# EAGLE board P1R5 (EAGLE 7.2.0)
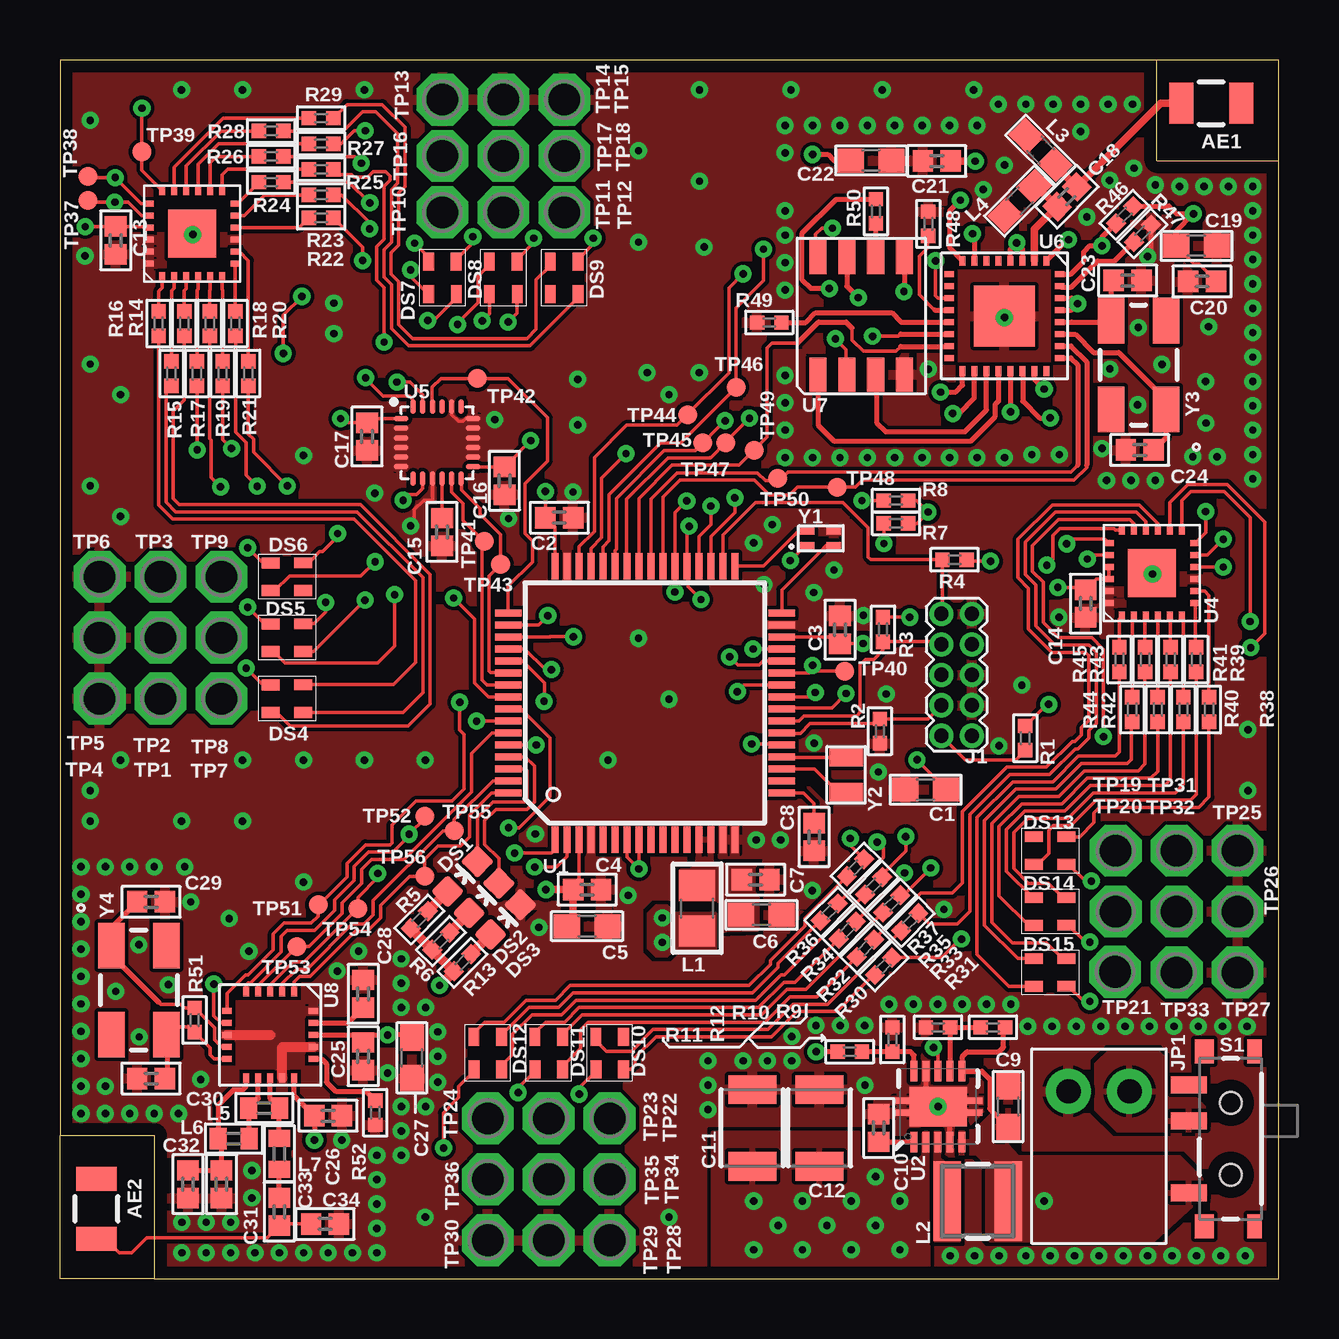
[diagram p6: board, top side]
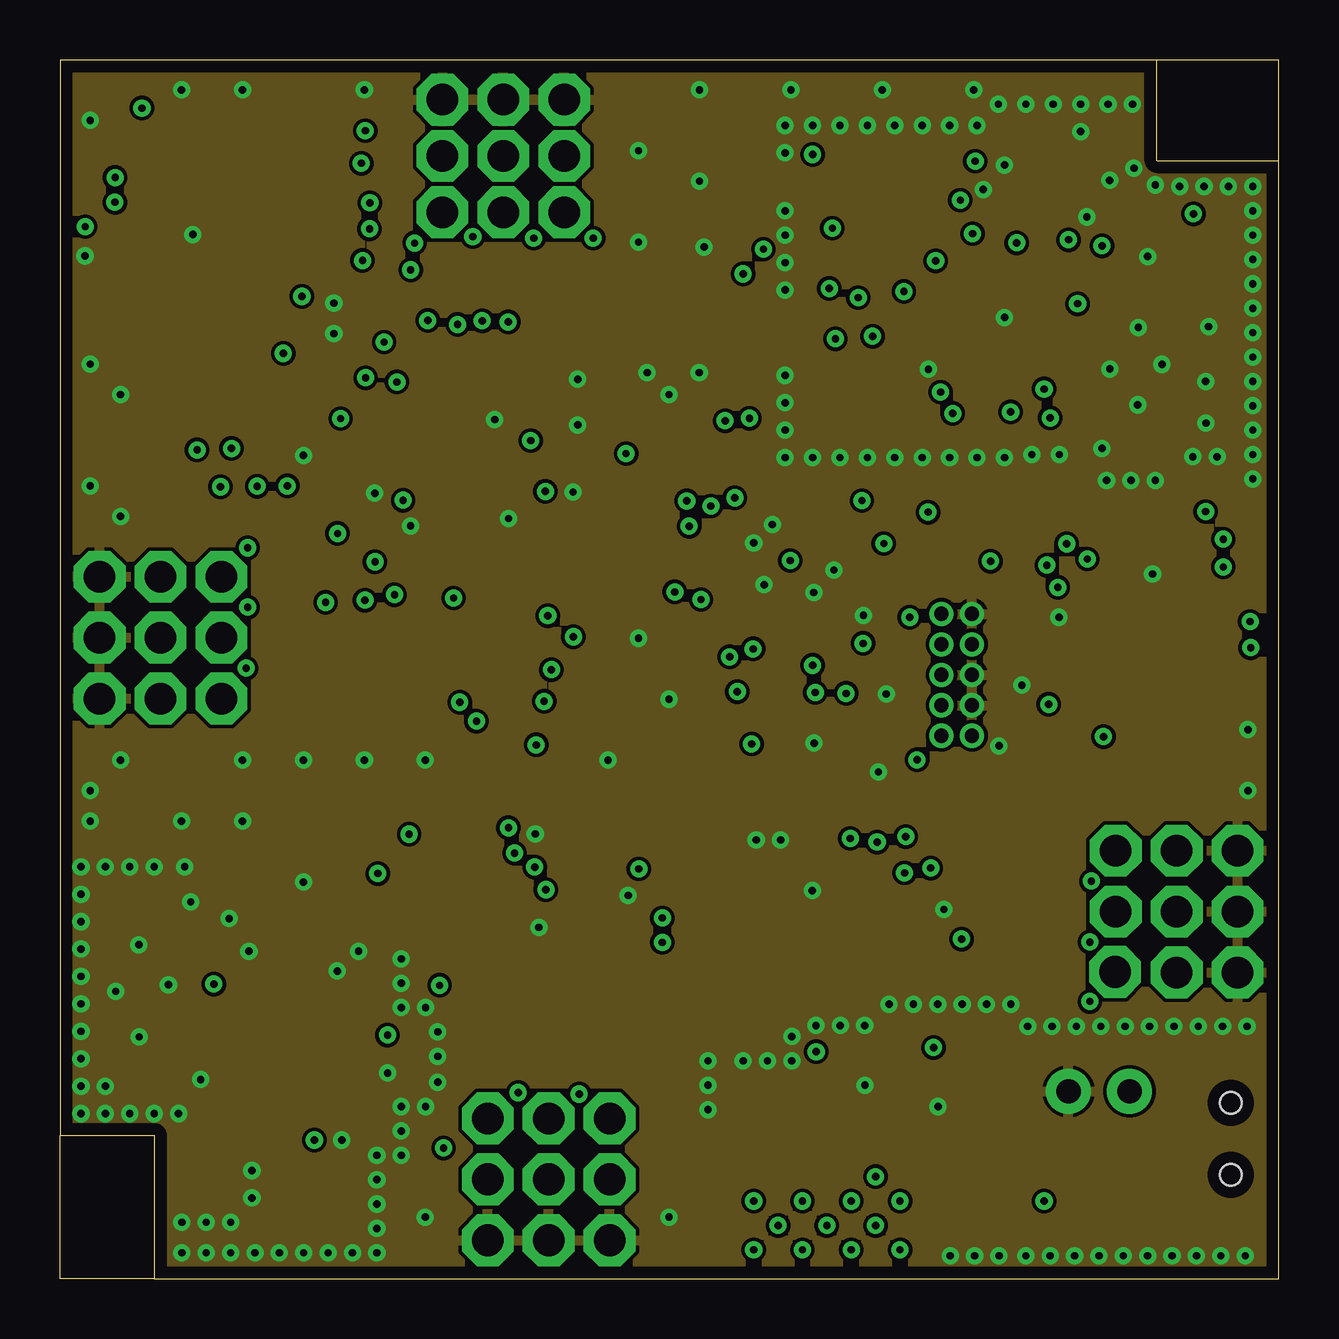
[diagram p7: board, inner layer Route2]
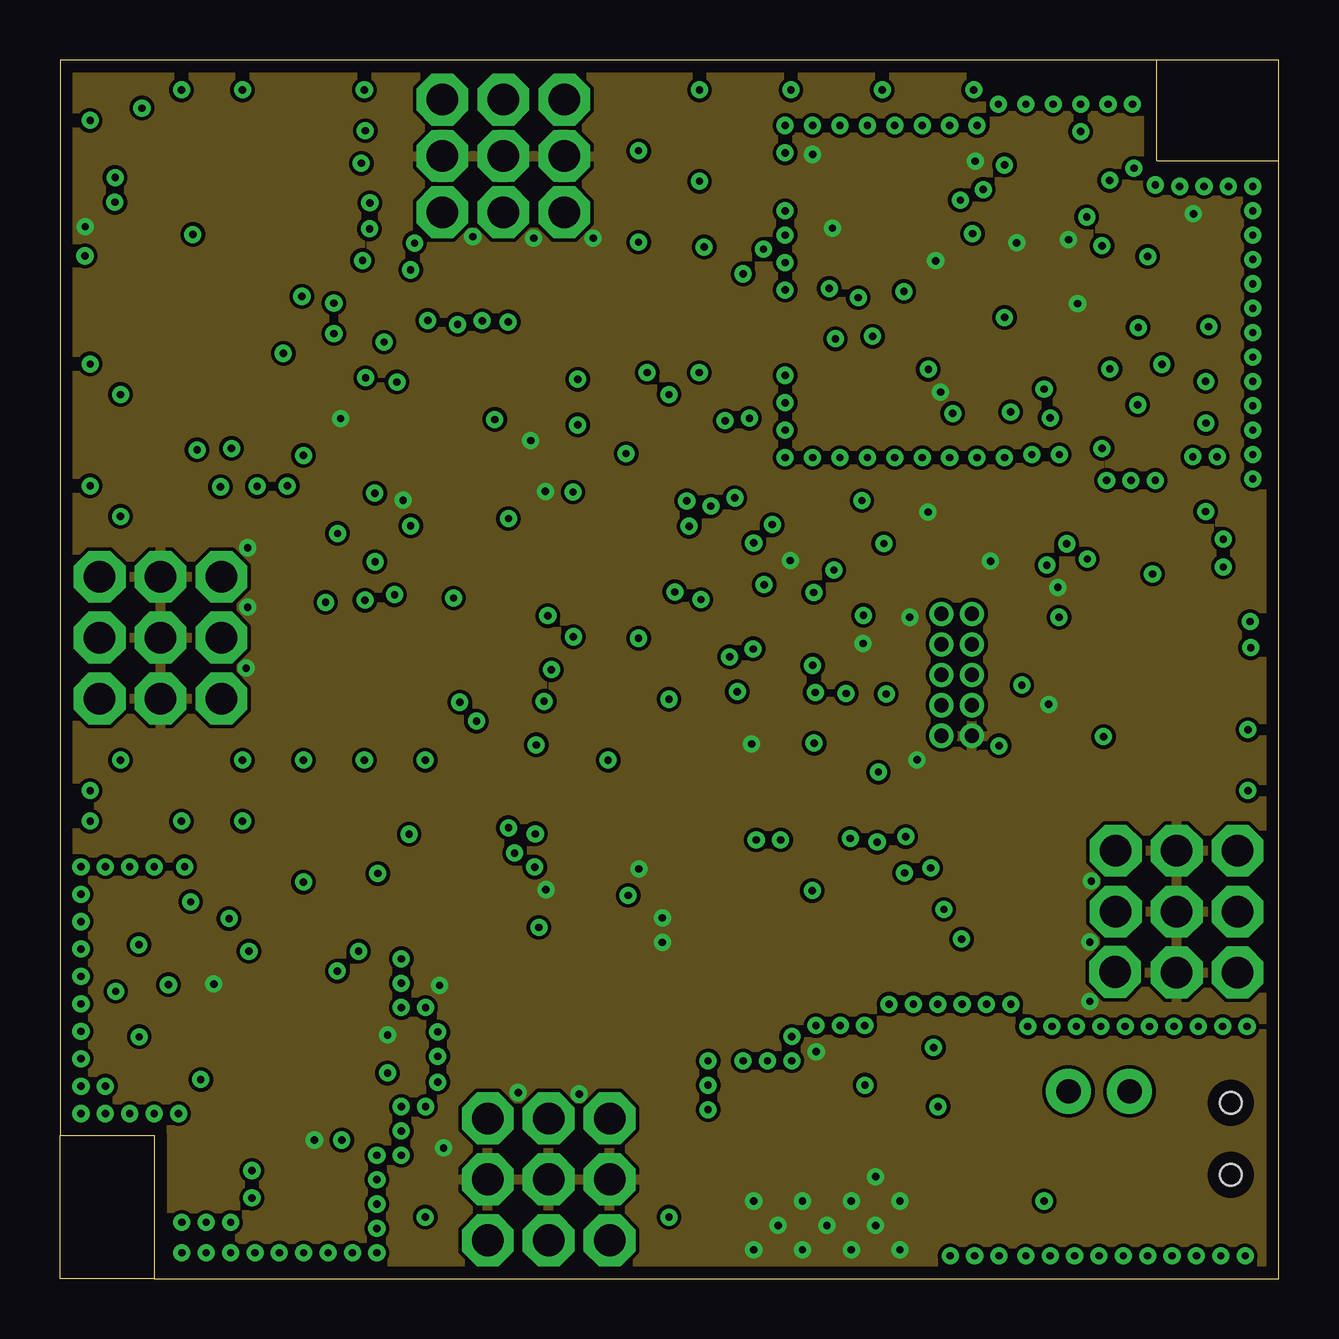
[diagram p8: board, inner layer Route15]
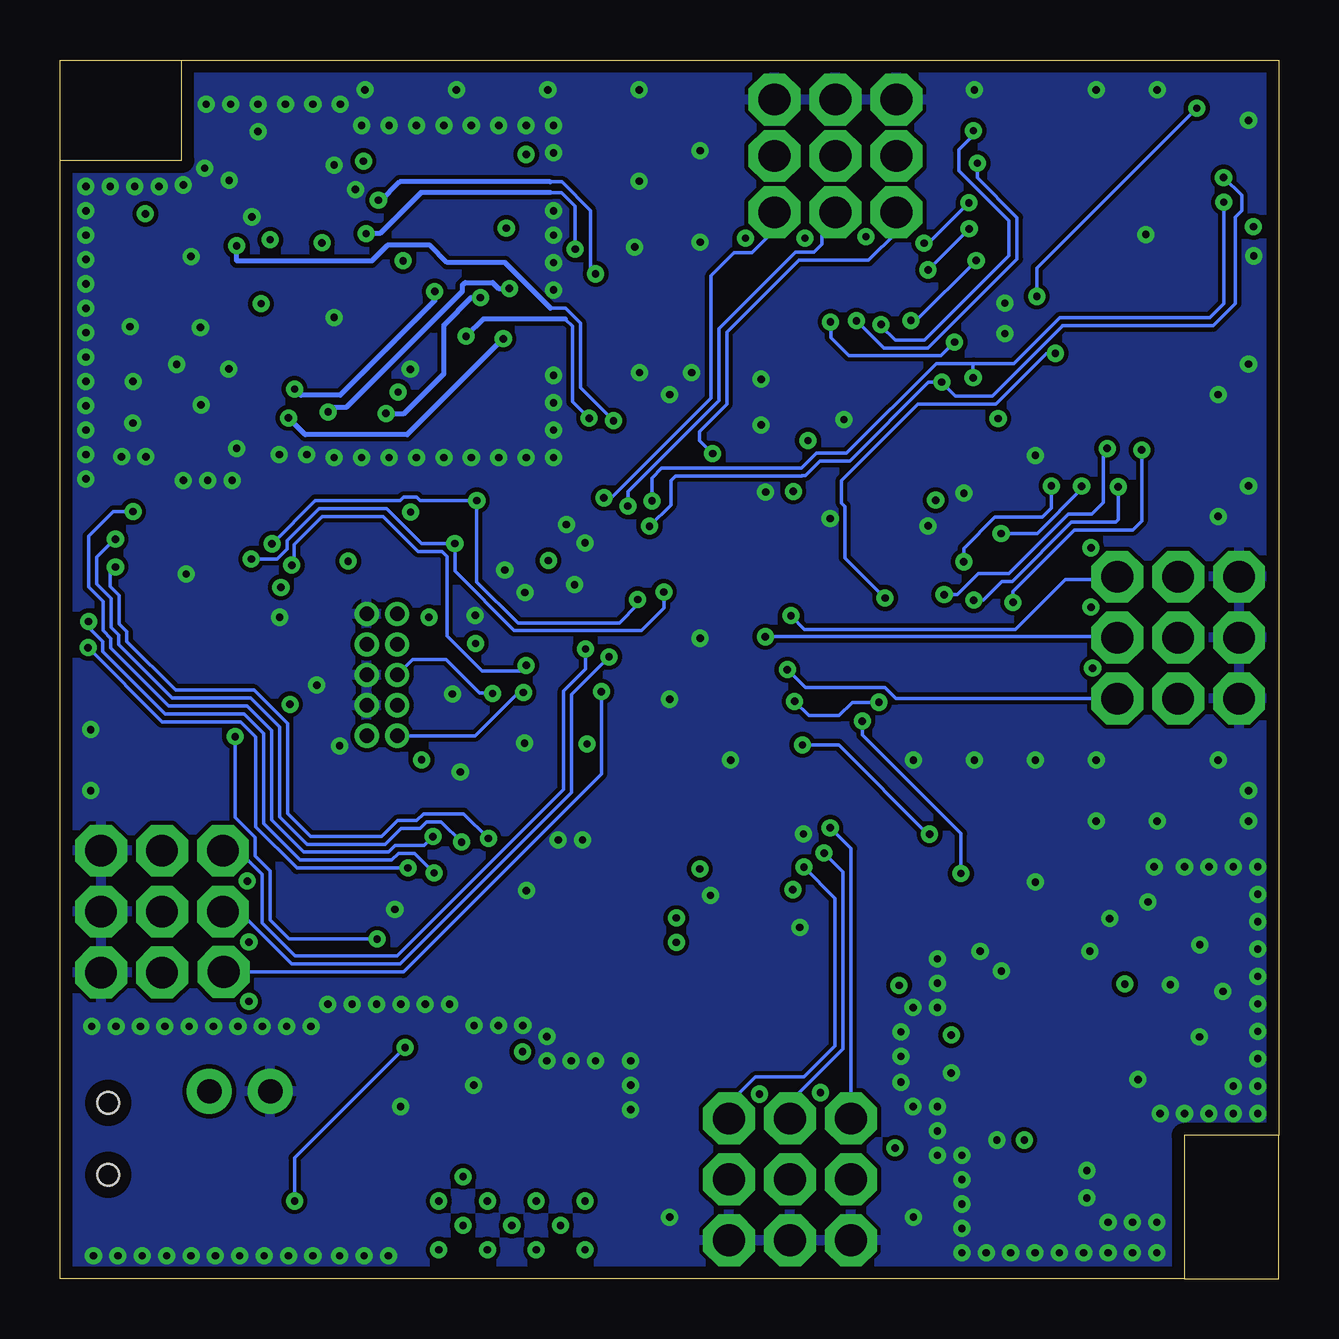
[diagram p9: board, bottom side, seen from below]

Size 50.8 x 50.8 mm. Coordinates in mm from the lower left corner, seen from the top.
Outline: 3.94,0 50.8,0 50.8,46.61
Outline: 45.72,50.8 0,50.8 0,5.97
Outline: 50.8,46.61 45.72,46.61 45.72,50.8
Outline: 50.8,46.61 50.8,50.8 45.72,50.8
Outline: 0,5.97 0,0 3.94,0
Outline: 0,5.97 3.94,5.97 3.94,0
Copper layers (1*2*15*16): Top 0.035559375mm / dielectric 10mil / Route2 0.035559375mm / dielectric 40mil / Route15 0.035559375mm / dielectric 10mil / Bottom 0.035559375mm
Design rules "Clay *": minimum track width 6mil, minimum drill 12mil, track to track 6mil, track to pad 6mil, pad to pad 6mil, via to via 6mil, smd to smd 6mil, copper to edge 20mil, drill to drill 28mil, minimum pad ring 8mil, minimum via ring 8mil, stop-mask expansion 1mil, vias tented up to drill 0mil, thermal gap 6mil
Net classes: 1 USB: width 0.254 mm, drill 0.33 mm, clearance 0.159 mm
bRestrict: area 46,47.6 to 50.5,50.3; area -0.1,0.9 to 3.9,5.7

## Footprints (pad centres in the part's own frame; a part is rotated, then mirrored left to right if it is on the bottom)
ANTENNA-CHIP2 = smd 1.7 x 1: FEED 0,1.25; P$2 0,-1.25
0603-CAP = smd 1.1 x 1: 1 -0.85,0; 2 0.85,0
0402-CAP = smd 0.85 x 0.9: 1 -0.58,0; 2 0.58,0
1210 = smd 1.2 x 2: 1 -1.6,0; 2 1.6,0
LED-0603 = smd 1 x 1: A 0,-0.877; C 0,0.877
LTST-C19FD1WT = smd 0.75 x 0.45: 1 0.68,0.58; 2 -0.68,0.58; 3 -0.68,-0.58; 4 0.68,-0.57
2X5_0.05"_TH_NS = drill 0.6 pad 0.95: 1 -2.54,-0.635; 2 -2.54,0.635; 3 -1.27,-0.635; 4 -1.27,0.635; 5 0,-0.635; 6 0,0.635; 7 1.27,-0.635; 8 1.27,0.635; 9 2.54,-0.635; 10 2.54,0.635
JST_2PIN = drill 1.016 pad 1.88: 1 0,0; 2 2.54,0
0805 = smd 1.3 x 1.5: 1 -0.95,0; 2 0.95,0
LPS3015 = smd 1.14 x 3.3: 1 -1.27,0; 2 1.27,0
0603 = smd 1.1 x 1: 1 -0.85,0; 2 0.85,0
C0402 = smd 0.7 x 0.9: 1 -0.65,0; 2 0.65,0
_0402 = smd 0.6 x 0.6: 1 -0.508,0; 2 0.508,0
SWITCH-SPST-SMD-A = smd 0.7 x 1.5: 1 -2.25,-1.75; 2 -0.75,-1.75; 3 2.25,-1.75 | smd 1 x 0.6: GND1 -3.65,1; GND3 3.65,1 | smd 1 x 0.8: GND2 -3.65,-1.1; GND4 3.65,-1.1 | hole 0.9: -1.5,0; 1.5,0
P1-13 = drill 1.321 pad 2.159 octagon: TP 0,0
TP08R = smd 0.8 x 0.8: TP 0,0
MK20DX256VLH7 = smd 1.1 x 0.285: 1 -5.7,3.75; 2 -5.7,3.25; 3 -5.7,2.75; 4 -5.7,2.25; 5 -5.7,1.75; 6 -5.7,1.25; 7 -5.7,0.75; 8 -5.7,0.25; 9 -5.7,-0.25; 10 -5.7,-0.75; 11 -5.7,-1.25; 12 -5.7,-1.75; 13 -5.7,-2.25; 14 -5.7,-2.75; 15 -5.7,-3.25; 16 -5.7,-3.75; 33 5.7,-3.75; 34 5.7,-3.25; 35 5.7,-2.75; 36 5.7,-2.25; 37 5.7,-1.75; 38 5.7,-1.25; 39 5.7,-0.75; 40 5.7,-0.25; 41 5.7,0.25; 42 5.7,0.75; 43 5.7,1.25; 44 5.7,1.75; 45 5.7,2.25; 46 5.7,2.75; 47 5.7,3.25; 48 5.7,3.75 | smd 0.285 x 1.1: 17 -3.75,-5.7; 18 -3.25,-5.7; 19 -2.75,-5.7; 20 -2.25,-5.7; 21 -1.75,-5.7; 22 -1.25,-5.7; 23 -0.75,-5.7; 24 -0.25,-5.7; 25 0.25,-5.7; 26 0.75,-5.7; 27 1.25,-5.7; 28 1.75,-5.7; 29 2.25,-5.7; 30 2.75,-5.7; 31 3.25,-5.7; 32 3.75,-5.7; 49 3.75,5.7; 50 3.25,5.7; 51 2.75,5.7; 52 2.25,5.7; 53 1.75,5.7; 54 1.25,5.7; 55 0.75,5.7; 56 0.25,5.7; 57 -0.25,5.7; 58 -0.75,5.7; 59 -1.25,5.7; 60 -1.75,5.7; 61 -2.25,5.7; 62 -2.75,5.7; 63 -3.25,5.7; 64 -3.75,5.7
QFN-10_PAD = smd 0.297 x 0.85: 1 -1,-1.475; 2 -0.5,-1.475; 3 0,-1.475; 4 0.5,-1.475; 5 1,-1.475; 6 1,1.475; 7 0.5,1.475; 8 0,1.475; 9 -0.5,1.475; 10 -1,1.475 | smd 0.7 x 0.28: 11 -1.5,0.25; 12 -1.5,-0.25; 13 1.5,0.25; 14 1.5,-0.25 | smd 2.4 x 1.65: 15 0,0
HVQFN24 = smd 0.4 x 0.25: 1 -1.8,1.25; 2 -1.8,0.75; 3 -1.8,0.25; 4 -1.8,-0.25; 5 -1.8,-0.75; 6 -1.8,-1.25; 13 1.8,-1.25; 14 1.8,-0.75; 15 1.8,-0.25; 16 1.8,0.25; 17 1.8,0.75; 18 1.8,1.25 | smd 0.25 x 0.4: 7 -1.25,-1.8; 8 -0.75,-1.8; 9 -0.25,-1.8; 10 0.25,-1.8; 11 0.75,-1.8; 12 1.25,-1.8; 19 1.25,1.8; 20 0.75,1.8; 21 0.25,1.8; 22 -0.25,1.8; 23 -0.75,1.8; 24 -1.25,1.8 | smd 2 x 2: P$1 0,0
QFN-24/3MM = smd 0.6 x 0.23: 1 -1.5,1; 2 -1.5,0.6; 3 -1.5,0.2; 4 -1.5,-0.2; 5 -1.5,-0.6; 6 -1.5,-1; 13 1.5,-1; 14 1.5,-0.6; 15 1.5,-0.2; 16 1.5,0.2; 17 1.5,0.6; 18 1.5,1 | smd 0.23 x 0.6: 7 -1,-1.5; 8 -0.6,-1.5; 9 -0.2,-1.5; 10 0.2,-1.5; 11 0.6,-1.5; 12 1,-1.5; 19 1,1.5; 20 0.6,1.5; 21 0.2,1.5; 22 -0.2,1.5; 23 -0.6,1.5; 24 -1,1.5
QFN32 = smd 0.4 x 0.25: 1 -2.3,1.75; 2 -2.3,1.25; 3 -2.3,0.75; 4 -2.3,0.25; 5 -2.3,-0.25; 6 -2.3,-0.75; 7 -2.3,-1.25; 8 -2.3,-1.75; 17 2.3,-1.75; 18 2.3,-1.25; 19 2.3,-0.75; 20 2.3,-0.25; 21 2.3,0.25; 22 2.3,0.75; 23 2.3,1.25; 24 2.3,1.75 | smd 0.25 x 0.4: 9 -1.75,-2.3; 10 -1.25,-2.3; 11 -0.75,-2.3; 12 -0.25,-2.3; 13 0.25,-2.3; 14 0.75,-2.3; 15 1.25,-2.3; 16 1.75,-2.3; 25 1.75,2.3; 26 1.25,2.3; 27 0.75,2.3; 28 0.25,2.3; 29 -0.25,2.3; 30 -0.75,2.3; 31 -1.25,2.3; 32 -1.75,2.3 | smd 2.54 x 2.54: PAD 0,0
SOP8 = smd 1.422 x 0.711: 1 -2.454,1.8; 2 -2.454,0.6; 3 -2.454,-0.6; 4 -2.454,-1.8; 5 2.454,-1.8; 6 2.454,-0.6; 7 2.454,0.6; 8 2.454,1.8
QFN20(4X4) = smd 0.4 x 0.25: 1 -1.8,1; 2 -1.8,0.5; 3 -1.8,0; 4 -1.8,-0.5; 5 -1.8,-1; 11 1.8,-1; 12 1.8,-0.5; 13 1.8,0; 14 1.8,0.5; 15 1.8,1 | smd 0.25 x 0.4: 6 -1,-1.8; 7 -0.5,-1.8; 8 0,-1.8; 9 0.5,-1.8; 10 1,-1.8; 16 1,1.8; 17 0.5,1.8; 18 0,1.8; 19 -0.5,1.8; 20 -1,1.8
ASCO = smd 0.61 x 0.305: ENABLE -0.6,0.3; GND 0.5,0.3; OUT 0.5,-0.3; VCC -0.6,-0.3
ABS06 = smd 0.762 x 1.397: P$1 -0.711,0; P$2 0.737,0
CRYSTAL-SMD-5X3 = smd 1.9 x 1.1: 1 -1.85,-1.15; 2 1.85,-1.15; 3 1.85,1.15; 4 -1.85,1.15

## Placement (x,y rotation side)
AE1  2450AT18A100E  [ANTENNA-CHIP2]  47.98,49 90 top
AE2  2450AT18A100E  [ANTENNA-CHIP2]  1.52,2.92 180 top
C1  10uF  [0603-CAP]  36.08,20.38 180 top
C2  0.1uF  [0402-CAP]  20.82,31.72 0 top
C3  0.1uF  [0402-CAP]  32.51,27.05 90 top
C4  0.1uF  [0402-CAP]  21.97,16.22 0 top
C5  10uF  [0603-CAP]  21.97,14.69 0 top
C6  10uF  [0603-CAP]  29.24,15.16 0 top
C7  0.1uF  [0402-CAP]  28.99,16.64 0 top
C8  0.1uF  [0402-CAP]  31.43,18.41 270 top
C9  10uF  [0603-CAP]  39.52,7.18 90 top
C10  0.1uF  [0402-CAP]  34.12,6.29 90 top
C11  22uF  [1210]  28.85,6.29 90 top
C12  22uF  [1210]  31.65,6.29 90 top
C13  0.1uF  [0402-CAP]  2.32,43.28 270 top
C14  0.1uF  [0402-CAP]  42.75,28.14 270 top
C15  0.1 uF  [0402-CAP]  15.93,31.13 90 top
C16  0.1 uF  [0402-CAP]  18.53,33.26 90 top
C17  0.1 uF  [0402-CAP]  12.8,35.1 270 top
C18  5.6 pF  [0402-CAP]  41.98,45.1 225 top
C19  10uF  [0603-CAP]  47.37,43.05 0 top
C20  0.1 uF  [0402-CAP]  47.6,41.57 0 top
C21  0.1 uF  [0402-CAP]  36.55,46.58 180 top
C22  10uF  [0603-CAP]  33.81,46.61 0 top
C23  15 pF  [0402-CAP]  44.5,41.61 0 top
C24  15 pF  [0402-CAP]  45.01,34.54 180 top
C25  0.1 uF  [0402-CAP]  12.64,9.27 270 top
C26  0.1 uF  [0402-CAP]  11.18,6.79 0 top
C27  10uF  [0603-CAP]  14.67,9.21 270 top
C28  .033 uF  [0402-CAP]  12.64,11.87 270 top
C29  22 pF  [0402-CAP]  3.8,15.71 0 top
C30  22 pF  [0402-CAP]  3.8,8.34 180 top
C31  2200 pF  [0402-CAP]  6.73,3.94 270 top
C32  4.7 pF  [0402-CAP]  5.33,3.94 270 top
C33  1.5 pF  [0402-CAP]  9.14,2.79 270 top
C34  1.0 pF  [0402-CAP]  11.05,2.29 0 top
DRILEGEND  [DRILEGEND]  -25.67,-27.96 0 top  (outside the outline)
DS1  LTST-C191TBKT  [LED-0603]  16.78,16.76 315 top
DS2  LTST-C191TBKT  [LED-0603]  17.67,15.87 315 top
DS3  LTST-C191TBKT  [LED-0603]  18.57,14.97 315 top
DS4  LTST-C19FD1WT  [LTST-C19FD1WT]  9.46,24.18 180 top
DS5  LTST-C19FD1WT  [LTST-C19FD1WT]  9.46,26.72 180 top
DS6  LTST-C19FD1WT  [LTST-C19FD1WT]  9.46,29.26 180 top
DS7  LTST-C19FD1WT  [LTST-C19FD1WT]  15.94,41.72 90 top
DS8  LTST-C19FD1WT  [LTST-C19FD1WT]  18.48,41.72 90 top
DS9  LTST-C19FD1WT  [LTST-C19FD1WT]  21.02,41.72 90 top
DS10  LTST-C19FD1WT  [LTST-C19FD1WT]  22.91,9.41 270 top
DS11  LTST-C19FD1WT  [LTST-C19FD1WT]  20.37,9.41 270 top
DS12  LTST-C19FD1WT  [LTST-C19FD1WT]  17.83,9.41 270 top
DS13  LTST-C19FD1WT  [LTST-C19FD1WT]  41.27,17.84 0 top
DS14  LTST-C19FD1WT  [LTST-C19FD1WT]  41.27,15.3 0 top
DS15  LTST-C19FD1WT  [LTST-C19FD1WT]  41.27,12.76 0 top
J1  2X5_0.05"_CORTEX_DEBUGTH_NOKEY_UNSHROUDED  [2X5_0.05"_TH_NS]  37.38,25.17 90 top
JP1  M20PTH  [JST_2PIN]  44.58,7.81 180 top
L1  600 Ohm/100 Mhz  [0805]  26.56,15.44 270 top
L2  2.2uH, 1.4A  [LPS3015]  38.25,3.24 0 top
L3  DNP  [0603]  40.88,47.04 135 top
L4  DNP  [0603]  39.99,44.93 225 top
L5  8.2 nH  [C0402]  8.51,7.11 180 top
L6  2.7 nH  [C0402]  7.24,5.84 180 top
L7  3.9 nH  [C0402]  9.14,5.21 270 top
R1  10k  [_0402]  40.23,22.53 270 top
R2  10k  [_0402]  34.18,22.82 90 top
R3  10k  [_0402]  34.3,27.06 270 top
R4  10k  [_0402]  37.29,29.97 180 top
R5  25  [_0402]  14.98,14.97 45 top
R6  25  [_0402]  15.88,14.07 45 top
R7  10k  [_0402]  34.85,31.48 180 top
R8  10k  [_0402]  34.85,32.44 180 top
R9  2M  [_0402]  38.89,10.48 0 top
R10  220K  [_0402]  36.6,10.48 0 top
R11  1.2M  [_0402]  32.92,9.46 180 top
R12  220K  [_0402]  34.7,9.97 270 top
R13  25  [_0402]  16.78,13.17 45 top
R14  86.6  [_0402]  4.11,39.81 270 top
R15  86.6  [_0402]  4.65,37.73 270 top
R16  86.6  [_0402]  5.18,39.81 270 top
R17  86.6  [_0402]  5.71,37.73 270 top
R18  86.6  [_0402]  6.25,39.81 270 top
R19  86.6  [_0402]  6.78,37.73 270 top
R20  86.6  [_0402]  7.32,39.81 270 top
R21  86.6  [_0402]  7.85,37.73 270 top
R22  86.6  [_0402]  10.88,44.22 0 top
R23  86.6  [_0402]  10.88,45.17 0 top
R24  86.6  [_0402]  8.8,45.71 0 top
R25  86.6  [_0402]  10.88,46.24 0 top
R26  86.6  [_0402]  8.8,46.77 0 top
R27  86.6  [_0402]  10.88,47.31 0 top
R28  86.6  [_0402]  8.8,47.84 0 top
R29  86.6  [_0402]  10.88,48.37 0 top
R30  86.6  [_0402]  34.33,13.02 225 top
R31  86.6  [_0402]  35.42,14.87 225 top
R32  86.6  [_0402]  33.57,13.78 225 top
R33  86.6  [_0402]  34.67,15.63 225 top
R34  86.6  [_0402]  32.82,14.53 225 top
R35  86.6  [_0402]  33.91,16.38 225 top
R36  86.6  [_0402]  32.06,15.28 225 top
R37  86.6  [_0402]  33.16,17.13 225 top
R38  86.6  [_0402]  47.89,23.72 270 top
R39  86.6  [_0402]  47.36,25.81 270 top
R40  86.6  [_0402]  46.82,23.72 270 top
R41  86.6  [_0402]  46.29,25.81 270 top
R42  86.6  [_0402]  45.76,23.72 270 top
R43  86.6  [_0402]  45.22,25.81 270 top
R44  86.6  [_0402]  44.69,23.72 270 top
R45  86.6  [_0402]  44.16,25.81 270 top
R46  12k  [_0402]  44.37,44.35 45 top
R47  12k  [_0402]  45.12,43.57 45 top
R48  12k  [_0402]  36.2,43.97 270 top
R49  10k  [_0402]  29.57,39.85 0 top
R50  200  [_0402]  34.01,44.49 90 top
R51  1M  [_0402]  5.61,10.78 270 top
R52  22k  [_0402]  13.14,6.92 270 top
S1  CUS-12TB  [SWITCH-SPST-SMD-A]  48.79,5.83 270 top
TP1  TPPAD1-13  [P1-13]  4.19,24.18 0 top
TP2  TPPAD1-13  [P1-13]  4.19,26.72 0 top
TP3  TPPAD1-13  [P1-13]  4.19,29.26 0 top
TP4  TPPAD1-13  [P1-13]  1.65,24.18 0 top
TP5  TPPAD1-13  [P1-13]  1.65,26.72 0 top
TP6  TPPAD1-13  [P1-13]  1.65,29.26 0 top
TP7  TPPAD1-13  [P1-13]  6.73,24.18 0 top
TP8  TPPAD1-13  [P1-13]  6.73,26.72 0 top
TP9  TPPAD1-13  [P1-13]  6.73,29.26 0 top
TP10  TPPAD1-13  [P1-13]  15.94,44.45 0 top
TP11  TPPAD1-13  [P1-13]  18.48,44.45 0 top
TP12  TPPAD1-13  [P1-13]  21.02,44.45 0 top
TP13  TPPAD1-13  [P1-13]  15.94,49.15 0 top
TP14  TPPAD1-13  [P1-13]  18.48,49.15 0 top
TP15  TPPAD1-13  [P1-13]  21.02,49.15 0 top
TP16  TPPAD1-13  [P1-13]  15.94,46.8 0 top
TP17  TPPAD1-13  [P1-13]  18.48,46.8 0 top
TP18  TPPAD1-13  [P1-13]  21.02,46.8 0 top
TP19  TPPAD1-13  [P1-13]  44.01,17.84 0 top
TP20  TPPAD1-13  [P1-13]  44.01,15.3 0 top
TP21  TPPAD1-13  [P1-13]  43.98,12.79 0 top
TP22  TPPAD1-13  [P1-13]  22.91,6.68 0 top
TP23  TPPAD1-13  [P1-13]  20.37,6.68 0 top
TP24  TPPAD1-13  [P1-13]  17.83,6.68 0 top
TP25  TPPAD1-13  [P1-13]  49.09,17.84 0 top
TP26  TPPAD1-13  [P1-13]  49.09,15.3 0 top
TP27  TPPAD1-13  [P1-13]  49.09,12.76 0 top
TP28  TPPAD1-13  [P1-13]  22.91,1.6 0 top
TP29  TPPAD1-13  [P1-13]  20.37,1.6 0 top
TP30  TPPAD1-13  [P1-13]  17.83,1.6 0 top
TP31  TPPAD1-13  [P1-13]  46.55,17.84 0 top
TP32  TPPAD1-13  [P1-13]  46.55,15.3 0 top
TP33  TPPAD1-13  [P1-13]  46.55,12.76 0 top
TP34  TPPAD1-13  [P1-13]  22.91,4.14 0 top
TP35  TPPAD1-13  [P1-13]  20.37,4.14 0 top
TP36  TPPAD1-13  [P1-13]  17.83,4.14 0 top
TP37  TPTP08R  [TP08R]  1.17,44.95 0 top
TP38  TPTP08R  [TP08R]  1.17,45.94 0 top
TP39  TPTP08R  [TP08R]  3.42,46.98 0 top
TP40  TPTP08R  [TP08R]  32.7,25.32 0 top
TP41  TPTP08R  [TP08R]  17.68,30.75 0 top
TP42  TPTP08R  [TP08R]  17.4,37.53 0 top
TP43  TPTP08R  [TP08R]  18.36,29.78 0 top
TP44  TPTP08R  [TP08R]  26.16,36.02 0 top
TP45  TPTP08R  [TP08R]  26.8,34.85 0 top
TP46  TPTP08R  [TP08R]  28.18,37.16 0 top
TP47  TPTP08R  [TP08R]  27.75,34.85 0 top
TP48  TPTP08R  [TP08R]  32.4,32.99 0 top
TP49  TPTP08R  [TP08R]  28.93,34.53 0 top
TP50  TPTP08R  [TP08R]  29.91,33.36 0 top
TP51  TPTP08R  [TP08R]  10.77,15.58 90 top
TP52  TPTP08R  [TP08R]  15.21,19.28 90 top
TP53  TPTP08R  [TP08R]  9.88,13.84 90 top
TP54  TPTP08R  [TP08R]  12.42,15.42 90 top
TP55  TPTP08R  [TP08R]  16.43,18.67 90 top
TP56  TPTP08R  [TP08R]  15.2,16.78 90 top
U1  MK20DX256VLH7  [MK20DX256VLH7]  24.38,24 90 top
U2  TPS61200  [QFN-10_PAD]  36.6,7.18 0 top
U3  PCA9552BS  [HVQFN24]  5.51,43.56 90 top
U4  PCA9552BS  [HVQFN24]  45.52,29.41 90 top
U5  MPU-9250  [QFN-24/3MM]  15.72,34.85 0 top
U6  ESP8266EX  [QFN32]  39.37,40.13 270 top
U7  25Q40  [SOP8]  33.4,40.13 90 top
U8  NRF24L01  [QFN20(4X4)]  8.76,10.16 270 top
Y1  8MHz  [ASCO]  31.75,30.86 0 top
Y2  34.728kHz  [ABS06]  32.77,21.02 270 top
Y3  26 Mhz  [CRYSTAL-SMD-5X3]  44.96,38.09 90 top
Y4  16 Mhz  [CRYSTAL-SMD-5X3]  3.29,12.03 270 top

## Tracks (layer width: path | path; a pad name or v marks a point on that pad's centre or on a via)
3.3V  (via drill 0.3 pad 0.2, 0.3 pad 0.61)
  Top 0.152: C19.1 47.28,42.29 47.5,42.29 48.18,41.61 C20.2 | U5.13 C16.2 v19.62,34.93 v19.62,34.94 | U5.1 12.97,35.85 C17.1 11.87,35.68 v11.7,35.85 | U1.3 21.63,16.46 C4.1 | 21.39,14.96 C5.1 | U1.8 v24.13,17.08 23.63,17.58 U1.7 | DS9.4 21.59,42.48 22.23,43.12 v22.23,43.37 | DS7.4 16.51,42.48 17.21,43.18 v17.21,43.43 | DS8.4 19.05,42.48 19.75,43.18 v19.75,43.37 | Y1.VCC 31.13,30.54 31.05,30.54 v30.44,29.93 | U1.21 30.05,22.29 v28.83,22.29 | U1.30 32.23,26.75 C3.1 v33.47,26.47 v33.48,26.48 | U3.21 3.66,43.86 C13.1 1.06,43.86 v1.05,43.85 | R4.1 37.86,29.91 v38.79,29.91 | 8.79,29.83 DS6.4 8.46,29.83 v7.82,30.47 | 8.79,24.75 DS4.4 8.46,24.75 v7.76,25.45 | DS5.4 8.52,27.29 v7.82,27.99 | DS12.4 17.26,8.65 16.62,8.01 16.62,7.56 15.99,6.92 v15.99,5.45 | DS10.4 22.34,8.65 21.64,7.95 v21.64,7.7 | DS11.4 19.8,8.65 19.1,7.95 v19.1,7.76 | DS15.4 42.04,12.19 42.67,11.56 v42.93,11.56 | DS13.4 42.04,17.27 42.74,16.57 v42.99,16.57 | DS14.4 42.04,14.73 42.74,14.03 v42.93,14.03 | U1.48 20.63,31.33 C2.1 v20.23,32.81 v20.23,32.82 | v41.59,28.82 42.66,28.82 C14.1 43.19,29.16 U4.22 U4.21 | R8.1 35.7,32.44 v36.18,31.95 35.71,31.48 R7.1 | R3.1 v35.42,27.57 | C1.1 36.93,20.42 v35.73,21.63 | R1.1 41.13,23.94 v41.21,23.94 | 31.5,43.18 31.5,43.54 31.75,43.79 v32.19,43.79 | v36.5,42.43 36.5,40.97 36.59,40.88 U6.11 | U8.7 6.71,10.66 6.41,10.96 v6.41,12.28 | U5.8 15.12,32.94 14.86,32.68 14.53,32.68 v14.3,32.45
  Top 0.203: R46.2 46.22,44.71 46.55,44.39 v47.24,44.39 46.52,43.66 C19.1 | U6.1 41.99,43.31 v42.04,43.31 | U6.4 39.62,42.93 v39.88,43.18 40.13,42.93 40.13,42.44 U6.3 | U6.30 42.18,40.88 v42.42,40.64 42.16,40.38 U6.29 | v31.37,46.86 32,46.86 32.26,46.61 C22.1 | 31.6,42.33 31.5,42.44 31.5,42.48 | 31.5,42.48 31.5,43.18 | v36.7,36.96 37.34,36.96 37.62,37.24 U6.17 | U6.11 37.06,40.89 | U8.18 12.33,10.16 C25.1 12.95,10.16 v13.65,10.16 14.57,10.16 C27.1 | U8.15 9.76,7.63 C26.1 v10.6,5.78 | U8.7 | R11.2 v31.52,9.46 | 31.5,42.48 U7.8
  Top 0.305: C21.1 v38.15,46.58 | 21.39,14.96 C4.1 v20.26,16.22
  Top 0.406: R5.1 R6.1 R13.1 15.83,12.23 v15.82,12.23
  other vias: 28.92,3.24 30.95,3.24 32.98,3.24 29.93,2.22 31.97,2.22 28.92,1.21 30.95,1.21 32.98,1.21 35.01,3.24 34,2.22 35.01,1.21 34,4.25 25.11,15.04 25.11,14.02
  pour Route15 (rank 6): -2.79,51.56 52.32,51.56 52.32,-1.02 -2.79,-1.02
  pour Top (isolate 0.152, rank 2, no thermals): 27.2,3.62 33.24,3.62 33.24,5.21 33.55,4.89 35.71,4.89 35.97,5.14 35.97,6.03 36.03,6.1 36.16,6.1 36.22,6.03 36.22,0.51 27.2,0.51
  pour Top (isolate 0.152): 27.2,6.1 33.3,6.1 33.3,3.62 27.2,3.62
  pour Top (isolate 0.152, no thermals): 27.33,15.23 25.62,15.23 25.3,15.54 24.85,15.54 24.54,15.23 24.54,13.77 24.85,13.45 25.3,13.45 25.62,13.77 27.33,13.77
!CS
  Top 0.152: 15.53,36.36 U5.22 15.52,37.16 15.89,37.53 TP42.TP 18.68,37.53 20.32,35.89 20.32,34.09 19.38,33.15 19.38,31.06 19.7,30.75 19.7,29.88 18.68,28.87 U1.49
!RESET0  (via drill 0.3 pad 0.2)
  Top 0.152: U3.18 3.42,46.21 TP39.TP v3.42,48.79 | U1.56 17.86,24.25 17.29,24.83 17.29,27.5 v16.41,28.37 | v9.31,38.57 9.31,40.17 v10.08,40.95
  Bottom 0.152: v10.08,40.95 10.08,42.13 v3.42,48.79 | v9.31,38.57 9.68,38.57 11.8,36.45 15.05,36.45 18.22,33.27 18.22,32.33 18.09,32.19 18.09,30.05 v16.41,28.37
!RESET1  (via drill 0.3, 0.3 pad 0.2)
  Top 0.152: U1.27 31.21,25.25 31.37,25.41 v31.37,25.57 31.61,25.32 TP40.TP 32.69,25.34 | U4.18 43.98,31.21 43.93,31.27 41.67,31.27 41.38,30.98 41.38,29.98 v41.13,29.74
  Bottom 0.152: v41.13,29.74 41.03,29.84 41.03,30.61 39.87,31.77 37.33,31.77 35.87,30.32 34.87,30.32 34.67,30.11 34.67,26.8 33.21,25.34 31.6,25.34 v31.37,25.57
CE
  Top 0.152: U8.1 9.76,12.38 9.98,12.6 10.43,12.6 12.31,14.48 12.8,14.48 13.36,15.04 13.36,15.56 14.58,16.78 TP56.TP 15.2,17.48 15.76,18.03 16.69,18.03 17.07,18.41 17.07,19.33 17.99,20.25 U1.64
CHIP_EN  (via drill 0.3 pad 0.2, 0.3 pad 0.61)
  Top 0.152: U1.44 22.63,30.51 22.89,30.76 22.89,32.68 25.03,34.82 25.87,34.82 28.18,37.13 TP46.TP 28.18,40.45 29.32,41.59 v29.32,42.91
  Top 0.203: v38.04,43.56 38.12,43.48 U6.7
  Bottom 0.152: 30.35,45.28 29.9,45.28 29.32,44.7 v29.32,42.91
  Bottom 0.203: 30.35,45.28 35.75,45.28 37.47,43.56 v38.04,43.56
CLK
  Top 0.203: R50.1 34.01,42.34 34,42.33 U7.6
CS
  Top 0.203: U6.20 39.12,36.58 38.99,36.45 38.99,35.94 37.97,34.92 32.26,34.92 31.6,35.58 U7.1 31.6,37.93
CSN
  Top 0.152: U8.2 9.26,12.31 9.86,12.9 10.3,12.9 12.18,14.78 12.68,14.78 13.06,15.16 13.06,15.76 15.96,18.67 TP55.TP 16.43,19.14 18.05,20.75 U1.63
DIO  (via drill 0.3 pad 0.2)
  Top 0.203: U7.5 35.2,41.17 v35.18,41.15 | v41.02,37.08 40.62,37.48 U6.23
  Bottom 0.203: v35.18,41.15 35.18,40.77 39.12,36.83 40.77,36.83 v41.02,37.08
DO  (via drill 0.3 pad 0.61)
  Top 0.152: v32.32,39.18 32.77,38.73 32.77,37.97
  Top 0.203: U6.22 40.13,37.82 40.13,36.58 40.83,35.88 v41.27,35.88 | 32.77,37.97 32.8,37.93 U7.2
  Bottom 0.203: v32.32,39.18 36.32,35.18 40.58,35.18 v41.27,35.88
FSYNC
  Top 0.152: U5.11 16.32,32.79 16.8,32.31 16.8,31.61 17.67,30.75 TP41.TP | U1.55 17.79,24.75 17.59,24.96 17.59,30.66 TP41.TP | 17.68,30.73 TP41.TP
GND  (via drill 0.3 pad 0.3)
  Top 0.152: U5.9 15.53,33.34 15.53,32.44 15.15,32.44 14.77,32.05 14.77,31.67 | 17.24,35.87 U5.18 17.21,35.87 16.93,35.87 16.8,35.74 16.61,35.74 16.32,36.03 U5.20 16.36,36.38
  Top 0.203: R47.2 45.47,43.92 45.47,42.74 v45.34,42.61 | U2.9 36.1,7.68 U2.15 | U2.4 37.1,6.68 U2.15 | U2.14 36.85,6.93 U2.15
  Top 0.406: U8.8 8.76,10.16 | U8.14 9.26,9.66 U8.17
  other vias: 43.69,48.96 42.55,48.96 41.4,48.96 40.26,48.96 39.12,48.96 38.23,48.07 37.08,48.07 35.94,48.07 34.8,48.07 33.66,48.07 32.51,48.07 31.37,48.07 30.23,48.07 30.23,46.93 30.23,44.51 30.23,43.5 30.23,42.35 30.23,41.21 30.23,37.66 31.37,34.23 32.51,34.23 33.66,34.23 30.23,36.51 30.23,35.37 34.8,34.23 35.94,34.23 37.08,34.23 38.23,34.23 39.37,34.23 40.51,34.35 41.66,34.35 44.64,33.27 45.66,33.27 47.22,34.26 48.23,34.26 39.37,40.07 49.72,35.37 49.72,36.39 49.72,37.4 49.72,38.42 49.72,39.43 49.72,41.47 49.72,42.48 49.72,43.5 49.72,44.51 49.72,45.53 45.66,45.59 48.7,45.53 46.67,45.53 47.69,45.53 43.75,45.78 30.23,34.23 42.8,44.26 36.2,37.91 38.48,45.4 39.37,46.42 42.55,47.82 49.72,40.45 43.43,34.61 47.88,39.69 47.75,37.4 47.76,35.66 44.77,46.29 44.7,48.96 0.88,17.17 8,3.37 8,4.51 5.08,1.08 6.1,1.08 7.11,1.08 8.13,1.08 1.89,8.03 0.88,9.17 0.88,10.31 0.88,11.46 0.88,12.6 0.88,13.74 0.88,14.88 0.88,16.03 1.89,17.17 2.91,17.17 3.92,17.17 5.19,17.17 7.05,15.01 13.65,8.57 11.75,5.78 5.87,8.31 9.14,1.08 10.16,1.08 11.18,1.08 12.19,1.08 13.21,1.08 13.21,2.1 13.21,3.11 13.21,4.13 13.21,5.14 14.22,7.18 14.22,5.14 14.22,6.16 15.24,7.18 15.75,8.19 15.75,9.27 15.75,10.29 15.24,11.3 14.22,11.3 14.22,12.32 14.22,13.34 12.45,13.65 11.56,12.83 49.72,34.35 49.72,33.34 43.62,33.27 36.6,7.18 33.55,8.06 37.11,0.95 38.13,0.95 39.14,0.95 40.26,0.95 41.27,0.95 42.29,0.95 43.31,0.95 44.32,0.95 45.34,0.95 46.35,0.95 47.37,0.95 48.39,0.95 49.4,0.95 27.01,7.05 27.01,8.06 27.01,9.08 28.47,9.08 29.49,9.08 30.51,9.08 30.51,10.1 31.51,10.55 32.52,10.55 33.54,10.55 34.56,11.44 35.57,11.44 36.59,11.44 37.6,11.44 38.62,11.44 39.64,11.44 40.34,10.52 41.35,10.52 42.37,10.52 43.38,10.52 44.4,10.52 45.42,10.52 46.43,10.52 47.45,10.52 48.46,10.52 45.54,29.38 5.54,43.52 5.08,2.35 6.1,2.35 7.11,2.35 13.12,32.74 23.69,15.98 29.02,18.29 30.04,18.29 18.12,35.81 21.39,32.79 1.04,42.63 33.49,27.65 31.42,28.6 28.92,30.67 5.45,15.71 7.87,13.65 34.44,24.37 19.96,14.64 49.48,10.52 29.35,28.93 19.81,18.54 41.64,27.57 18.69,31.69 31.36,16.18 32.26,29.54 29.69,31.43 36.84,15.39 34.11,21.12 40.09,24.74 39.14,22.21 31.43,22.33 2.53,21.62 7.61,21.62 10.15,21.62 12.69,21.62 15.23,21.62 5.07,19.08 7.61,19.08 10.15,16.54 2.53,31.78 2.53,36.86 1.26,33.05 1.26,20.35 1.26,19.08 25.39,2.57 15.23,2.57 1.26,38.13 1.26,48.29 5.07,49.56 7.61,49.56 12.69,49.56 24.12,47.02 26.66,49.56 24.12,43.21 26.66,45.75 24.47,37.77 25.39,36.86 30.47,49.56 34.28,49.56 38.09,49.56 21.58,37.49 21.58,35.59 10.15,34.32 11.42,40.67 11.42,39.4 22.85,21.62 25.39,24.16 24.12,26.7 49.52,20.35 49.52,22.89 2.32,11.98 4.52,12.26 45.94,38.11 44.92,36.42 43.76,37.92 44.95,39.65 3.3,10.08 3.29,13.92 0.88,6.88 0.88,8.03 1.89,6.88 3.92,6.88 2.91,6.88 4.94,6.88 26.64,37.77 26.85,43 14.62,31.38
  pour Top (isolate 0.152, rank 6): -7.11,51.56 53.85,51.56 53.85,-1.02 -7.11,-1.02
  pour Route2 (rank 6): -4.83,51.56 53.09,51.56 53.09,-1.02 -4.83,-1.02
  pour Bottom (isolate 0.178, rank 6): -1.02,-1.02 51.56,-1.02 51.56,51.56 -1.02,51.56
  pour Top (isolate 0.152, rank 2): 28,20.45 31.24,20.45 32,19.68 32,17.27 31.69,17.27 30.63,16.27 30.67,14.61 30.44,14.41 27.94,14.49 27.62,14.81 27.62,20.07
GPIO0
  Top 0.152: 30.73,38.99 29.67,38.99 29.46,38.79 29.46,35.08 28.93,34.54 TP49.TP 28.31,33.91 25.51,33.91 24.13,32.53 U1.41 | 35.05,38.86 34.85,38.66 33.49,38.66 33.02,39.13 33.02,39.62
  Top 0.203: 30.73,38.99 31.62,39.88 32.77,39.88 33.02,39.62 | 35.05,38.86 37.05,38.86 U6.15
GPIO2  (via drill 0.3 pad 0.2, 0.3 pad 0.61)
  Top 0.152: 28.73,35.87 v28.74,35.87 27.75,34.87 TP47.TP 27.13,34.23 27.09,34.23 27.09,34.21 25.34,34.21 23.62,32.5 23.62,29.71 | 35.04,39.38 34.94,39.28 v33.87,39.28
  Top 0.203: U1.42 23.62,29.71 | 35.04,39.38 U6.14
  Bottom 0.152: v28.74,35.87 28.75,35.87 29.44,36.55 29.44,39.7 29.74,40.01
  Bottom 0.203: 29.74,40.01 33.15,40.01 v33.87,39.28
HOLD#  (via drill 0.3 pad 0.2)
  Top 0.203: U6.18 38.1,37.81 38.1,36.7 37.47,36.07 v37.21,36.07 | U7.7 32.8,41.37 v33.27,40.89
  Bottom 0.203: v37.21,36.07 36.45,36.07 34.8,37.72 34.8,39.75 33.66,40.89 v33.27,40.89
INT
  Top 0.152: U5.12 16.74,33.33 16.74,32.88 17.51,32.11 17.51,31.88 18.36,31.03 TP43.TP 18.36,29.76 17.89,29.29 17.89,25.34 17.96,25.27 18.66,25.27 U1.54
IRQ  (via drill 0.3 pad 0.2)
  Top 0.152: U8.6 6.96,11.89 7.73,12.66 7.84,12.66 8.89,13.72 8.89,14.38 9.34,14.82 10.48,14.82 10.76,15.1 10.76,15.58 TP51.TP 10.81,15.58 11.96,16.74 11.96,17.31 12.74,18.09 13.75,18.09 13.84,18.17 13.84,18.91 14.85,19.91 16.34,19.91 16.85,20.42 16.85,22.68 16.66,22.87 v16.66,24.03 | U1.53 19.28,25.75 20.19,24.84 20.19,24.08 v20.18,24.07
  Bottom 0.152: v20.18,24.07 19.58,23.47 18.33,23.47 17.77,24.03 v16.66,24.03
MISO  (via drill 0.3 pad 0.2)
  Top 0.152: U8.5 7.76,12.11 7.76,12.26 7.84,12.33 7.94,12.33 9.22,13.61 9.22,14.28 9.46,14.52 10.62,14.52 11.46,15.35 11.46,15.8 12.27,16.61 12.27,17.18 12.87,17.78 13.88,17.78 14.55,18.45 v14.55,18.53 15.21,19.19 TP52.TP | v19.85,22.25 U1.60
  Bottom 0.152: v19.85,22.25 18.34,22.25 14.59,18.5 14.57,18.53 v14.55,18.53
MOSI
  Top 0.152: U8.4 8.26,12.22 TP53.TP 10.38,13.84 11.76,15.23 11.76,15.67 12.57,16.48 12.57,17.06 12.99,17.48 14.34,17.48 17.16,20.3 17.16,21.89 18.02,22.75 U1.59
N$1
  Top 0.152: U1.32 30.08,28.71 31.81,30.44 31.85,30.48 | Y1.OUT 32.23,30.56 32.14,30.48 31.85,30.48 | 31.85,30.48 31.93,30.56
N$2
  Top 0.152: 31.12,31.09 31.15,31.12 Y1.ENABLE 30.78,31.16 29.32,29.7 U1.33
N$3  (via drill 0.3 pad 0.3, 0.3 pad 0.61)
  Top 0.203: U6.21 v39.62,36.13 | v32.07,41.27 31.29,41.27 30.94,41.63 30.94,43.57 32.36,45 R50.2
  Bottom 0.203: v32.07,41.27 32.51,41.27 32.77,41.53 33.91,41.53 34.04,41.4 34.04,41.15 38.86,36.32 39.62,36.32 v39.62,36.13
N$4
  Top 0.152: U5.10 C15.2
N$5  (via drill 0.3 pad 0.2)
  Top 0.152: U1.52 19.36,26.25 20.23,25.39 v20.48,25.39
  Bottom 0.152: TP7.TP 15.95,24.18 16.41,24.64 19.74,24.64 v20.48,25.39
N$6  (via drill 0.3)
  Top 0.152: U1.51 20.43,26.75 20.43,26.76 v21.4,26.76
  Bottom 0.152: v21.4,26.76 6.77,26.76 TP8.TP
N$7
  Top 0.406: R5.2 DS1.A
N$8
  Top 0.152: U1.19 31.45,21.25 32.42,20.28 Y2.P$2
N$9
  Top 0.152: U1.20 30.11,21.73 Y2.P$1
N$10
  Top 0.152: U1.62 19.39,21.25 19.47,21.17 19.47,20 19.34,19.88 18.05,19.88 17.4,19.23 DS1.C
N$11  (via drill 0.3)
  Top 0.152: U1.50 19.95,27.25 v20.33,27.64
  Bottom 0.152: TP9.TP 6.84,29.15 8.9,29.15 10.99,27.06 19.76,27.06 v20.33,27.64
N$12  (via drill 0.3 pad 0.2)
  Top 0.152: U1.45 22.13,30.44 22.58,30.89 22.58,33.38 v23.6,34.39
  Bottom 0.152: v23.6,34.39 24.14,34.94 24.14,35.32 23,36.46 23,39.46 20,42.46 17.09,42.46 15.94,43.61 TP10.TP
N$13
  Top 0.152: U1.61 19.39,21.75 19.77,21.37 19.77,19.88 19.47,19.57 18.17,19.57 17.7,19.1 17.7,18.11 18.3,17.51 DS2.C
N$14  (via drill 0.3 pad 0.2)
  Top 0.152: U1.36 26.63,30.94 27.13,31.43 v27.13,32.21
  Bottom 0.152: v27.13,32.21 27.13,32.8 23.33,36.6 23.33,39.6 20.14,42.79 19.38,42.79 19.04,43.13 19.04,43.89 TP11.TP
N$15  (via drill 0.3 pad 0.2)
  Top 0.152: U1.35 27.13,30.93 28.13,31.93 v28.13,32.55
  Bottom 0.152: v28.13,32.55 27.81,32.55 23.66,36.7 23.66,41.81 22.71,42.76 21.96,42.76 21.02,43.7 TP12.TP
N$16  (via drill 0.3 pad 0.2)
  Top 0.152: U1.57 19.21,23.75 20.43,22.53 20.43,20.1 19.13,18.8 v18.69,18.8
  Bottom 0.152: TP24.TP 17.83,17.93 v18.69,18.8
N$17  (via drill 0.3 pad 0.2)
  Top 0.152: U1.26 28.51,24.75 v28.23,24.47
  Bottom 0.152: TP21.TP 43.16,12.79 42.75,12.79 36.49,12.79 28.23,21.04 v28.23,24.47
N$18  (via drill 0.3 pad 0.2)
  Top 0.152: U1.2 21.13,17.6 20.69,17.16 v19.79,17.16
  Bottom 0.152: TP22.TP 22.91,7.3 21.81,8.41 19.8,8.41 18.49,9.72 18.49,15.86 v19.79,17.16
N$19  (via drill 0.3 pad 0.2)
  Top 0.152: U1.1 20.63,17.88 20.5,17.74 v18.95,17.74
  Bottom 0.152: TP23.TP 20.37,7.37 18.16,9.58 18.16,16.95 v18.95,17.74
N$20  (via drill 0.3 pad 0.2)
  Top 0.152: U1.29 v28.89,26.25
  Bottom 0.152: v28.89,26.25 28.89,25.41 29.81,24.5 29.81,20.4 36.75,13.45 41.01,13.45 42.38,14.82 42.38,16.85 43.37,17.84 TP19.TP
N$21  (via drill 0.3 pad 0.2)
  Top 0.152: U1.28 29.31,25.75 29.14,25.58 28.25,25.58 v27.91,25.92
  Bottom 0.152: v27.91,25.92 29.48,24.36 29.48,20.27 36.63,13.12 41.15,13.12 43.33,15.3 TP20.TP
N$22
  Top 0.305: L4.1 40.73,45.53 C18.2 40.62,43.74 U6.2
N$23
  Top 0.203: U6.27 41.68,39.37 42.32,39.37 43.08,38.61 44.13,38.61 46.11,36.63 Y3.1 46.11,35.06 C24.1
N$24
  pour Top (isolate 0.152, no thermals): 36.47,6.1 36.47,1.59 37.49,1.59 37.49,4.83 36.86,4.83 36.66,5.02 36.66,6.1
N$25
  Top 0.152: C10.1 34.19,5.7
  Top 0.203: 34.19,5.7 U2.1
N$26
  Top 0.203: U2.7 R10.2 R9.1
N$27
  Top 0.203: U2.10 35.6,9.32 35.46,9.46 R12.2 R11.1
N$28
  Top 0.406: R13.2 DS3.A | DS3.A
N$29
  Top 0.406: R6.2 DS2.A | DS2.A
N$36  (via drill 0.3 pad 0.2)
  Top 0.152: DS8.2 17.9,40.23 v17.6,39.93 | v12.56,46.49 12.28,46.77 R26.2
  Bottom 0.152: v17.6,39.93 16.46,38.79 14.63,38.79 10.91,42.51 10.91,44.23 12.56,45.88 v12.56,46.49
N$37  (via drill 0.3 pad 0.2)
  Top 0.152: R23.2 11.75,45.17 12.9,44.02 v12.9,43.76 | v14.62,42.05 14.62,41.77 15.35,41.04 DS7.2
  Bottom 0.152: v12.9,43.76 v14.62,42.05
N$38  (via drill 0.3 pad 0.2)
  Top 0.152: R24.2 12.04,45.71 12.9,44.84 v12.92,44.84 | v14.78,43.17 15.36,42.59 DS7.1
  Bottom 0.152: v12.92,44.84 14.59,43.17 v14.78,43.17
N$39  (via drill 0.3 pad 0.2)
  Top 0.152: R22.2 12.61,43 v12.61,42.44 | v15.33,39.94 15.58,39.94 16.52,40.88 DS7.3
  Bottom 0.152: v12.61,42.44 15.11,39.94 v15.33,39.94
N$40  (via drill 0.3 pad 0.2)
  Top 0.152: v16.57,39.78 16.57,39.84 17.42,40.69 17.42,41.8 17.89,42.26 17.9,42.26 DS8.1 | R27.2 11.72,47.31 12.27,47.85 v12.72,47.85
  Bottom 0.152: v16.57,39.78 16.57,39.71 15.98,39.12 14.77,39.12 11.24,42.65 11.24,44.09 13.34,46.19 13.34,47.05 12.72,47.66 v12.72,47.85
N$41  (via drill 0.3 pad 0.2)
  Top 0.152: R25.2 11.43,46.24 11.65,46.02 12.15,46.02 12.27,45.91 12.81,45.91 13.04,46.14 13.58,46.14 13.77,45.95 13.77,45.8 13.51,45.54 13.51,43.33 13.2,43.02 13.2,41.62 13.51,41.3 v13.51,39.04 | v18.68,39.88 19.06,40.26 DS8.3
  Bottom 0.152: v18.68,39.88 18.67,39.87 18.67,39.23 17.92,38.48 14.07,38.48 v13.51,39.04
N$42
  Top 0.152: DS10.3 22.33,9.94 22.78,9.49 23.81,9.49 24.71,10.39 29.5,10.39 30.56,11.44 31.99,11.44 R31.2
N$43
  Top 0.152: DS10.1 23.77,8.73 23.77,8.72 23.98,8.93 23.98,9.22 24.84,10.08 29.65,10.08 30.71,11.14 32.38,11.14 33.91,12.66 R30.2
N$44
  Top 0.152: R29.2 11.96,48.95 13.44,48.95 14.38,48.01 14.38,45.52 14.12,45.26 14.12,43.08 13.8,42.76 13.8,41.87 14.12,41.55 14.12,39.78 14.71,39.19 19.47,39.19 19.85,39.57 19.85,41.64 20.44,42.23 DS9.1
N$45
  Top 0.152: R28.2 11.81,47.84 12.61,48.64 13.16,48.64 14.07,47.73 14.07,45.66 13.82,45.4 13.82,43.2 13.5,42.89 13.5,41.74 13.82,41.43 13.82,39.61 14.54,38.89 19.6,38.89 21.6,40.89 DS9.3
N$46
  Top 0.152: R14.1 4.12,41.17 4.26,41.32 U3.1
N$47  (via drill 0.3)
  Top 0.152: R18.2 6.25,35.01 6.3,34.96 6.3,33.4 v6.69,33.01 | v12.71,28.28 10.57,26.14 DS5.2
  Bottom 0.152: v6.69,33.01 6.69,31.65 6.79,31.55 8.64,31.55 11.11,29.07 11.53,29.07 12.32,28.28 v12.71,28.28
N$48
  Top 0.152: R15.1 4.65,41.19 4.76,41.3 U3.2
N$49
  Top 0.152: R16.1 5.18,41.19 5.26,41.27 U3.3
N$50
  Top 0.152: DS14.1 41.8,15.88 41.2,16.48 40.37,16.48 39.75,17.11 39.75,18.59 40.35,19.19 42.01,19.19 43.08,20.26 46.48,20.26 46.83,20.6 R40.2
N$51
  Top 0.152: R15.2 4.42,36.99 4.42,32.37 4.83,31.97 12.39,31.97 15.13,29.23 15.13,24.43 14.29,23.6 DS4.2
N$52
  Top 0.152: DS11.2 20.95,10.18 21.77,11 29.25,11 30.3,12.05 31.09,12.05 R33.2
N$53
  Top 0.152: R16.2 5.18,36.63 4.72,36.17 4.72,32.51 4.97,32.27 12.52,32.27 15.43,29.36 15.43,23.95 14.52,23.04 9.59,23.04 9.03,23.6 DS4.1
N$54
  Top 0.152: R14.2 4.12,32.24 4.7,31.66 12.27,31.66 14.82,29.11 14.82,25.68 13.9,24.76 DS4.3
N$55  (via drill 0.3)
  Top 0.152: R19.2 6.78,34.98 v7.15,34.61 | v13.95,28.51 13.95,26.36 13.25,25.67 9.38,25.67 8.91,26.14 DS5.1
  Bottom 0.152: v7.15,34.61 7.3,34.45 7.3,32.36 7.79,31.88 8.78,31.88 11.25,29.4 12.51,29.4 13.4,28.51 v13.95,28.51
N$56  (via drill 0.3)
  Top 0.152: R17.2 v5.71,34.54 | DS5.3 10.59,27.3 11.07,27.79 v11.07,28.19
  Bottom 0.152: v5.71,34.54 5.71,31.59 6.08,31.22 8.51,31.22 11.07,28.65 v11.07,28.19
N$57
  Top 0.152: DS15.3 39.56,12.18 38.23,13.51 38.23,19.23 39.71,20.71 41.38,20.71 42.44,21.78 43.98,21.78 44.16,21.96 R45.2
N$58
  Top 0.152: DS12.1 18.41,8.9 18.87,9.36 18.87,10.2 19.67,11 20.9,11 21.51,11.61 28.99,11.61 30.05,12.66 30.2,12.66 R35.2
N$59
  Top 0.152: R39.2 47.36,20.18 47.13,19.95 43.2,19.95 42.14,18.89 41.41,18.89 41.22,18.69 41.22,17.73 40.76,17.26 DS13.3
N$60
  Top 0.152: 5.71,41.71 U3.4 5.76,41.25 5.71,41.2 R17.1
N$61
  Top 0.152: DS11.3 19.79,10.25 20.23,10.69 21.03,10.69 21.64,11.3 29.12,11.3 30.18,12.36 30.64,12.36 R34.2
N$62
  Top 0.152: 45.76,22.86 R42.2 45.76,21.14 45.48,20.87 42.82,20.87 41.76,19.8 40.09,19.8 39.14,18.85 39.14,15.96 40.38,14.72 DS14.3
N$63
  Top 0.152: DS11.1 20.95,8.86 21.69,9.6 21.69,10.38 22.01,10.69 29.38,10.69 30.43,11.75 31.55,11.75 R32.2
N$64
  Top 0.152: DS12.3 17.25,10.25 17.69,10.69 18.5,10.69 19.42,11.61 20.65,11.61 21.26,12.22 28.73,12.22 29.62,13.11 29.62,13.27 31.05,14.71 31.05,15.03 R37.2
N$65  (via drill 0.3)
  Top 0.152: R21.2 7.85,35.2 8.06,34.99 8.06,34.45 v9.47,33.05 | DS6.1 8.96,28.68 9.56,29.29 12.54,29.29 v13.13,29.88
  Bottom 0.152: v9.47,33.05 9.47,32.12 9.84,31.75 11.82,31.75 13.13,30.44 v13.13,29.88
N$66  (via drill 0.3)
  Top 0.152: R20.2 7.32,35.29 7.76,34.85 7.76,33.49 v8.22,33.03 | DS6.3 10.36,29.84 10.83,30.32 10.95,30.32 11.57,30.94 v11.57,31.06
  Bottom 0.152: v8.22,33.03 8.22,32.91 10.06,31.06 v11.57,31.06
N$67
  Top 0.152: R41.2 46.29,20.8 46.05,20.56 42.95,20.56 41.88,19.49 40.22,19.49 39.45,18.72 39.45,16.98 40.54,15.88 DS14.2
N$68
  Top 0.152: DS13.1 42.52,18.42 43.1,19.01 43.1,19.42 43.33,19.65 47.46,19.65 47.89,20.08 R38.2
N$69
  Top 0.152: R18.1 6.25,41.2 6.26,41.21 U3.5
N$70
  Top 0.152: R43.2 45.23,21.45 44.95,21.17 42.7,21.17 41.63,20.1 39.97,20.1 38.84,18.97 38.84,14.86 39.69,14.01 41.11,14.01 41.77,13.34 DS15.1
N$71
  Top 0.152: U3.6 6.76,41.22 6.78,41.2 R19.1
N$72
  Top 0.152: R20.1 U3.7
N$73
  Top 0.152: 7.42,42.81 U3.8 7.48,42.81 7.85,42.44 R21.1
N$74
  Top 0.152: U3.10 9.97,43.81 R22.1
N$75
  Top 0.152: U3.11 7.67,44.31 8.53,45.17 R23.1
N$76
  Top 0.152: U3.12 7.4,44.81 R24.1
N$77
  Top 0.152: U3.13 6.76,46.02 6.99,46.24 R25.1
N$78
  Top 0.152: U3.14 6.26,46.52 6.51,46.77 R26.1
N$79
  Top 0.152: U3.15 5.76,46.45 6.62,47.31 R27.1
N$80
  Top 0.152: U3.16 5.26,46.38 6.72,47.84 R28.1
N$81
  Top 0.152: U3.17 4.76,46.33 6.81,48.37 R29.1
N$82
  Top 0.152: DS12.2 18.41,10.17 19.55,11.3 20.78,11.3 21.39,11.91 28.87,11.91 29.92,12.97 29.92,13.14 R36.2
N$83
  Top 0.152: DS15.2 39.92,13.34 38.53,14.73 38.53,19.1 39.84,20.41 41.5,20.41 42.57,21.48 44.49,21.48 44.67,21.65 44.67,23.19 R44.2
N$84  (via drill 0.3)
  Top 0.152: R30.1 36.75,13.39 37.53,14.16 v37.58,14.16 | U4.17 44.77,31.47 44.59,31.65 41.62,31.65 40.54,30.57 40.54,29.48 40.98,29.03 40.98,27.34 41.6,26.72 43,26.72 43.5,26.23 v43.5,22.59
  Bottom 0.152: v37.58,14.16 41.25,14.16 42.05,14.96 42.05,16.99 42.67,17.61 42.67,18.4 43.5,19.23 v43.5,22.59
N$85
  Top 0.152: U4.16 45.27,31.55 44.87,31.95 41.49,31.95 40.23,30.7 40.23,29.35 40.68,28.91 40.68,27.22 41.48,26.42 42.88,26.42 43.19,26.1 43.19,23.15 42.89,22.85 42.89,22.54 42.43,22.09 42.32,22.09 41.25,21.02 39.59,21.02 37.92,19.36 37.92,15.3 37.4,14.78 36.25,14.78 35.8,15.23 R31.1
N$86
  Top 0.152: R32.1 35.88,16.08 37.2,16.08 37.62,16.5 37.62,19.48 39.46,21.32 41.12,21.32 42.19,22.39 42.3,22.39 42.58,22.67 42.58,22.97 42.89,23.28 42.89,25.97 42.75,26.11 41.35,26.11 40.37,27.09 40.37,28.78 39.93,29.22 39.93,30.82 41.36,32.26 45,32.26 45.77,31.49 U4.15
N$87  (via drill 0.3)
  Top 0.152: R33.1 35.16,15.98 v36.3,17.12 | U4.14 46.27,32.36 47.02,33.11 48.65,33.11 50.22,31.55 50.22,26.89 v49.63,26.3
  Bottom 0.152: v36.3,17.12 40.92,17.12 42.63,18.83 42.63,22.58 43.27,23.22 46.55,23.22 v49.63,26.3
N$88  (via drill 0.3)
  Top 0.152: R34.1 v35.2,16.92 | v35.2,16.92 | v49.61,27.39 49.61,31.73 48.53,32.8 47.14,32.8 46.77,32.43 U4.13
  Bottom 0.152: v35.2,16.92 36.02,17.73 36.69,17.73 36.97,17.45 40.78,17.45 42.3,18.97 42.3,22.72 43.13,23.55 46.41,23.55 49.01,26.15 49.01,26.56 49.61,27.15 v49.61,27.39
N$89  (via drill 0.3)
  Top 0.152: R35.1 34.27,16.85 35.26,17.83 v35.26,18.43 | v47.75,31.98 47.75,31.1 U4.12
  Bottom 0.152: v35.26,18.43 35.62,18.06 36.83,18.06 37.11,17.78 40.64,17.78 41.97,19.11 41.97,22.86 42.99,23.88 46.27,23.88 48.68,26.29 48.68,26.7 49,27.01 49,28.22 49.61,28.83 49.61,30.95 48.58,31.98 v47.75,31.98
N$90  (via drill 0.3)
  Top 0.152: R36.1 34.16,17.38 34.16,17.39 34.33,17.55 34.33,17.93 v34.06,18.2 | v48.49,30.82 47.83,30.16 U4.11
  Bottom 0.152: v34.06,18.2 34.91,19.05 35.51,19.05 35.79,18.77 36.59,18.77 37.25,18.11 40.5,18.11 41.64,19.25 41.64,23 42.85,24.21 46.13,24.21 48.35,26.43 48.35,26.84 48.67,27.15 48.67,28.35 49.28,28.96 49.28,30.07 48.53,30.82 v48.49,30.82
N$91  (via drill 0.3)
  Top 0.152: R37.1 32.94,18.07 v32.94,18.35 | v48.49,29.67 U4.10
  Bottom 0.152: v32.94,18.35 33.97,19.38 35.65,19.38 35.93,19.1 36.73,19.1 37.39,18.44 40.36,18.44 41.31,19.39 41.31,23.14 42.71,24.54 45.99,24.54 48.02,26.57 48.02,26.98 48.34,27.29 48.34,28.49 48.7,28.85 48.7,29.45 v48.49,29.67
N$92
  Top 0.152: U4.8 47.71,28.66 47.89,28.49 R38.1
N$93
  Top 0.152: R39.1 47.32,26.36 U4.7
N$94
  Top 0.152: U4.6 46.83,27.55 R40.1
N$95
  Top 0.152: U4.5 46.29,27.59 R41.1
N$96
  Top 0.152: U4.4 45.76,27.61 R42.1
N$97
  Top 0.152: U4.3 45.23,27.57 R43.1
N$98
  Top 0.152: U4.2 44.69,27.54 R44.1
N$99
  Top 0.152: U4.1 44.16,27.5 R45.1
N$100
  Top 0.203: C23.1 43.81,41.49 Y3.3 | 43.75,39.88 Y3.3 | U6.28 42.16,39.88 42.17,39.87 43.74,39.87 Y3.3
N$101
  Top 0.305: AE1.FEED 45.88,49 C18.1 41.48,46.41 L3.1
N$102
  Top 0.152: 36.45,40.38 35.81,41.02 35.81,42.62 36.16,42.96 36.16,43.42 R48.2
  Top 0.203: 36.45,40.38 U6.12
N$103
  Top 0.203: R49.2 31.09,39.85 31.5,40.26 34.67,40.26 35.05,39.88 36.96,39.88 U6.13
N$104
  pour Top (isolate 0.152): 47.75,6.29 47.75,7.11 47.37,7.49 46.23,7.49 46.04,7.68 46.04,9.21 45.72,9.53 43.75,9.53 43.18,8.95 43.18,7.05 44.07,6.16 47.62,6.16
N$107
  Top 0.203: U6.31 41.71,41.34 42.16,41.34 43.24,42.42 43.94,42.42 44.74,43.21 R47.1
N$108
  Top 0.152: U8.9 6.75,9.66 6.45,9.96 6.45,10.45 R51.1 5.17,11.29 5.03,11.43 4.2,11.43 4.12,11.52
  Top 0.203: C29.1 2.14,14.63 Y4.1 2.14,13.49 4.12,11.52
N$109
  Top 0.152: U8.10 6.42,9.16 6.26,9.32 6.26,9.63 R51.2 5.38,10.5 4.76,10.5
  Top 0.203: 4.76,10.5 Y4.3 4.44,9.61 4.5,9.55 4.5,8.46 C30.1
N$111
  Top 0.203: L7.1 9.14,7.1 L5.1 8.76,7.51 U8.13
N$112
  Top 0.203: U8.16 10.91,9.16 11.11,8.95 11.11,8.19 11.49,7.81 12.76,7.81 R52.1
N$113
  Top 0.203: U8.19 12,10.66 C28.2
N$114
  Top 0.203: L6.1 7.89,7.08 L5.2 8.26,7.52 U8.12
N$115
  Top 0.152: AE2.FEED 1.67,1.52 2.03,1.52 2.48,1.08 2.98,1.08 3.62,1.71 8.64,1.71 C33.2 9.22,2.29 C34.1
N$116
  Top 0.203: C33.1 L7.2
N$117
  Top 0.203: C32.1 C31.1 6.73,5.7 L6.2 6.59,7.22 7.24,7.87 7.62,7.87 7.75,8 7.75,8.34 U8.11
N$1000
  pour Top (isolate 0.152, rank 3): 30.48,14.41 30.71,14.59 30.63,16.27 31.69,17.27 32,17.27 32,19.68 31.24,20.45 28,20.45 27.62,20.07 27.71,14.48
PTA0
  Top 0.152: U1.22 30.1,22.73 30.86,22.73 31.27,23.14 33.98,23.14 R2.2 36.17,23.33 J1.4
PTA1
  Top 0.152: U1.23 30.81,23.25 31.01,23.46 33.21,23.46 33.35,23.6 33.35,25.6 33.57,25.82 33.92,25.82 34.3,26.2 R3.2 36.63,26.56 J1.8
PTA2  (via drill 0.3 pad 0.2)
  Top 0.152: v32.77,24.4 32.17,23.8 30.24,23.8 30.19,23.75 U1.24
  Bottom 0.152: J1.6 36.11,25.81 34.7,25.81 33.31,24.42 32.79,24.42 v32.77,24.4
PTA3  (via drill 0.3 pad 0.2)
  Top 0.152: U1.25 31.38,24.25 31.38,24.33 v31.48,24.43 | R1.2 39.84,21.63 37.74,21.63 J1.2
  Bottom 0.152: J1.2 33.5,22.63 31.77,24.36 31.56,24.36 v31.48,24.43
RESET_B
  Top 0.152: U1.34 27.63,31 28.99,32.36 32.64,32.36 33.68,31.32 33.68,30.09 33.8,29.97 33.88,29.97 R4.2 36.78,27.75 J1.10
SCK  (via drill 0.3 pad 0.2)
  Top 0.152: U8.3 8.76,12.24 9.73,13.21 10.17,13.21 12.38,15.42 TP54.TP 12.42,15.9 13.25,16.73 v13.25,16.89 | v17.36,23.24 17.37,23.25 U1.58
  Bottom 0.152: v13.25,16.89 13.25,18.55 17.36,22.67 v17.36,23.24
SCL  (via drill 0.3, 0.3 pad 0.2)
  Top 0.152: v26.23,31.37 26.13,31.28 U1.37 26.13,29.52 26.19,29.46 26.19,28.84 v26.72,28.31 | U3.19 3.38,44.81 v2.3,45.9 1.21,45.9 TP38.TP | v33.43,32.44 R8.2 | U4.19 43.56,30.82 42.15,30.82 v41.96,30.63 | U5.23 15.12,36.85 14.59,37.38 v14.05,37.38
  Bottom 0.152: v26.23,31.37 25.34,32.26 25.34,33.27 25.15,33.47 19.88,33.47 19.86,33.48 19.74,33.48 19.13,34.09 17.88,34.09 14.59,37.38 v14.05,37.38 14.05,37.35 13.47,36.78 11.94,36.78 9.02,39.7 9.02,39.73 2.73,39.73 1.8,40.65 1.82,40.66 1.82,44.25 1.55,44.51 1.55,45.16 2.29,45.9 v2.3,45.9 | v26.72,28.31 26.72,28.09 27.48,27.33 31.71,27.33 33.43,29.05 v33.43,32.44 35.79,32.44 35.93,32.58 36.47,32.58 36.61,32.44 40.16,32.44 v41.96,30.63
SDA  (via drill 0.3, 0.3 pad 0.2)
  Top 0.152: v26.12,32.42 25.63,31.93 U1.38 v25.63,28.63 | U3.20 3.4,44.31 2.85,44.87 v2.29,44.87 1.25,44.87 TP37.TP | U5.24 14.71,36.37 14.71,36.65 14.57,36.79 13.46,36.79 12.74,37.52 v12.74,37.55 | U4.20 43.09,30.16 42.93,30 v42.82,30 | v34.34,30.64 R7.2
  Bottom 0.152: v26.12,32.42 26.12,33.38 25.72,33.78 19.9,33.78 19.28,34.4 18.01,34.4 14.26,38.15 12.71,38.15 | v2.29,44.87 2.29,40.64 2.87,40.06 9.13,40.06 11.04,38.15 12.71,38.15 | v25.63,28.63 25.63,27.96 26.57,27.03 31.88,27.03 34.34,29.49 v34.34,30.64 35.73,30.64 37.19,32.11 40.01,32.11 41.34,30.77 41.34,30.42 41.76,30 v42.82,30 | v12.74,37.55 12.74,38.12 12.71,38.15
U0RX
  Top 0.152: 42.42,33.91 42.14,33.63 30.35,33.63 30.09,33.36 TP50.TP 29.82,33.27 29.4,33.27 29.08,33.59 25.72,33.59 24.63,32.51 U1.40
  Top 0.203: U6.25 42.14,38.38 42.42,38.1 42.42,33.91
U0TX
  Top 0.152: 42.8,33.91 42.8,33.82 42.27,33.29 33.44,33.29 33.15,32.99 TP48.TP 30.84,32.99 30.76,32.99 30.73,32.99 30.4,32.66 29.58,32.66 28.96,33.29 25.84,33.29 25.13,32.58 U1.39
  Top 0.203: U6.26 42.14,38.88 42.8,38.23 42.8,33.91
V_IN  (via drill 0.3)
  Top 0.152: U2.8 36.6,9.45 v36.41,9.64 | v41.02,3.24 41.07,3.29
  Top 0.203: R9.2 39.33,10.41 39.33,9.65 39.14,9.46 37.81,9.46 37.62,9.27 37.62,8.67 U2.6 38.43,8.65 38.76,8.32 38.76,7.09 C9.1
  Bottom 0.152: v36.41,9.64 41.02,5.03 v41.02,3.24
  pour Top (isolate 0.152): 47.75,3.24 47.43,3.24 45.59,1.59 38.76,1.59 38.63,1.71 38.63,4.76 38.19,5.21 37.49,5.21 37.43,5.27 37.43,6.1 37.49,6.16 38.13,6.16 39.01,7.05 40.09,7.05 39.5,6.73 39.5,5.59 39.94,5.08 46.67,5.08 47.75,4
VDDA
  pour Top (isolate 0.152, no thermals): 25.86,15.81 27.28,15.81 27.28,17.28 26.54,17.28 26.29,17.03 25.88,17.03 25.86,17.01
  pour Top (isolate 0.152): 27.2,18.83 26.54,18.83 26.54,17.25 27.18,17.25
  pour Top (no thermals): 25.86,15.79 27.38,15.79 27.75,15.42 27.7,14.5 27.76,14.49 29.1,14.54 29.1,17.27 27.47,17.27 27.33,17.13 26.39,17.13 26.29,17.03 26.29,16.22
VREF_OUT
  Top 0.152: U1.17 30.99,20.26 31.43,19.81 C8.1
WIFI_RESET  (via drill 0.3 pad 0.2)
  Top 0.152: v27.72,35.76 26.48,34.52 | 26.48,34.52 25.18,34.52 23.19,32.52 23.19,30.42 23.13,30.36 U1.43 23.12,29.72 | 26.48,34.52 26.48,34.53 TP45.TP
  Top 0.203: R46.1 43.43,43.41 v43.43,43.05 42.93,43.05 42.67,42.8 42.67,42.42 42.14,41.88 U6.32
  Bottom 0.152: 30.35,40.45 29.72,40.45 29.11,39.84 29.11,37.15 v27.72,35.76
  Bottom 0.203: 30.35,40.45 32.26,42.35 34.66,42.35 35.38,43.08 37.16,43.08 37.16,43.07 37.81,42.42 43.43,42.42 v43.43,43.05
WP#
  Top 0.203: 34,37.93 34.04,37.9 34.04,37.74 | 34.04,37.74 34.04,35.69 34.42,35.31 37.72,35.31 38.62,36.21 U6.19 | U7.3 34,37.71 34.04,37.74
XPD_DCDC  (via drill 0.3 pad 0.2, 0.3 pad 0.61)
  Top 0.152: U1.46 21.63,30.51 22.28,31.15 22.28,34.23 23.62,35.57 25.72,35.57 TP44.TP 27.88,37.74 27.88,41.29 v28.47,41.88
  Top 0.203: U6.8 37.08,42.97 37.08,44.51 v37.53,44.96
  Bottom 0.152: 30.37,45.72 29.88,45.72 28.69,44.53 28.69,42.1 v28.47,41.88
  Bottom 0.203: v37.53,44.96 37.47,44.9 36.64,45.72 30.37,45.72

## Text on the board
Top: Top
Route2: GND
Route15: 3.3v
Bottom: Bottom
Measures: Label location / (on bottom)
Document: PCB: / - HASL finish / - Green LPI solder mask / - White silkscreen / - Panelization is at discretion of manufacturer. / - Artwork files for this PCB / --- Top layer / --- Second layer (gnd) / --- Third layer (pwr) / --- Bottom layer / --- Top soldermask / --- Bottom soldermask / --- Top silkscreen / --- Drill file / --- Top solder paste mask / - Board outline is square. Outlines drawn inside the square (top right, bottom left) should be ignored. / / / / Assembly: / - CBA is to be labeled on bottom side as shown / --- Line 1: CLAY P1R5 / --- Line 2: Name of manufacturer / --- Line 3: Serial number of fomat YYWWXXXX / ------ WW: Week of manufacture / ------ YY: Year of manufacture / ------ XXXX: Unique serial number for the week of manufacture | Clay G5.1 / 2015-09-24 / GBH
tSilk: SCL | +Y | +Z | 9 | 8 | 7 | -Z | 5.1 | RX | TX | 1 | 0 | 1 | 1 | 1 | 2 | +X | -X | 6 | Clay | 5 | 4 | 1 | 2 | 3 | -Y
DrillLegend: LAYER-STACK
DrillLegend_01-16: 01-16
DrillLegend_01-20: 01-20